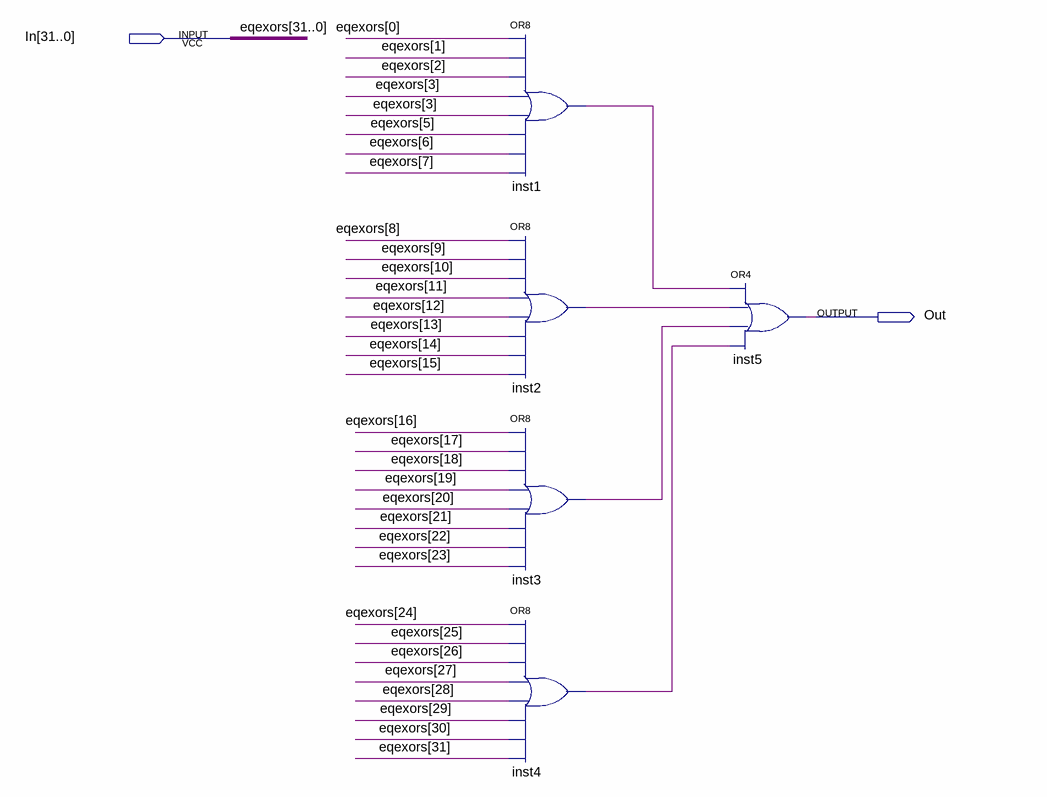
[diagram p0: schematic sheet]
// Quartus schematic or32.bdf as structural Verilog: 5 symbols, 2 pins
module or32 (
  input  [31:0] In,
  output Out
);

  wire inst1_out, inst2_out, inst3_out, inst4_out;

  or inst1 (inst1_out, In[0], In[1], In[2], In[3], In[3], In[5], In[6], In[7]);
  or inst2 (inst2_out, In[8], In[9], In[10], In[11], In[12], In[13], In[14], In[15]);
  or inst3 (inst3_out, In[16], In[17], In[18], In[19], In[20], In[21], In[22], In[23]);
  or inst4 (inst4_out, In[24], In[25], In[26], In[27], In[28], In[29], In[30], In[31]);
  or inst5 (Out, inst1_out, inst2_out, inst3_out, inst4_out);

  // Other names for the same wires on the sheet: eqexors[31:0] = In
endmodule
